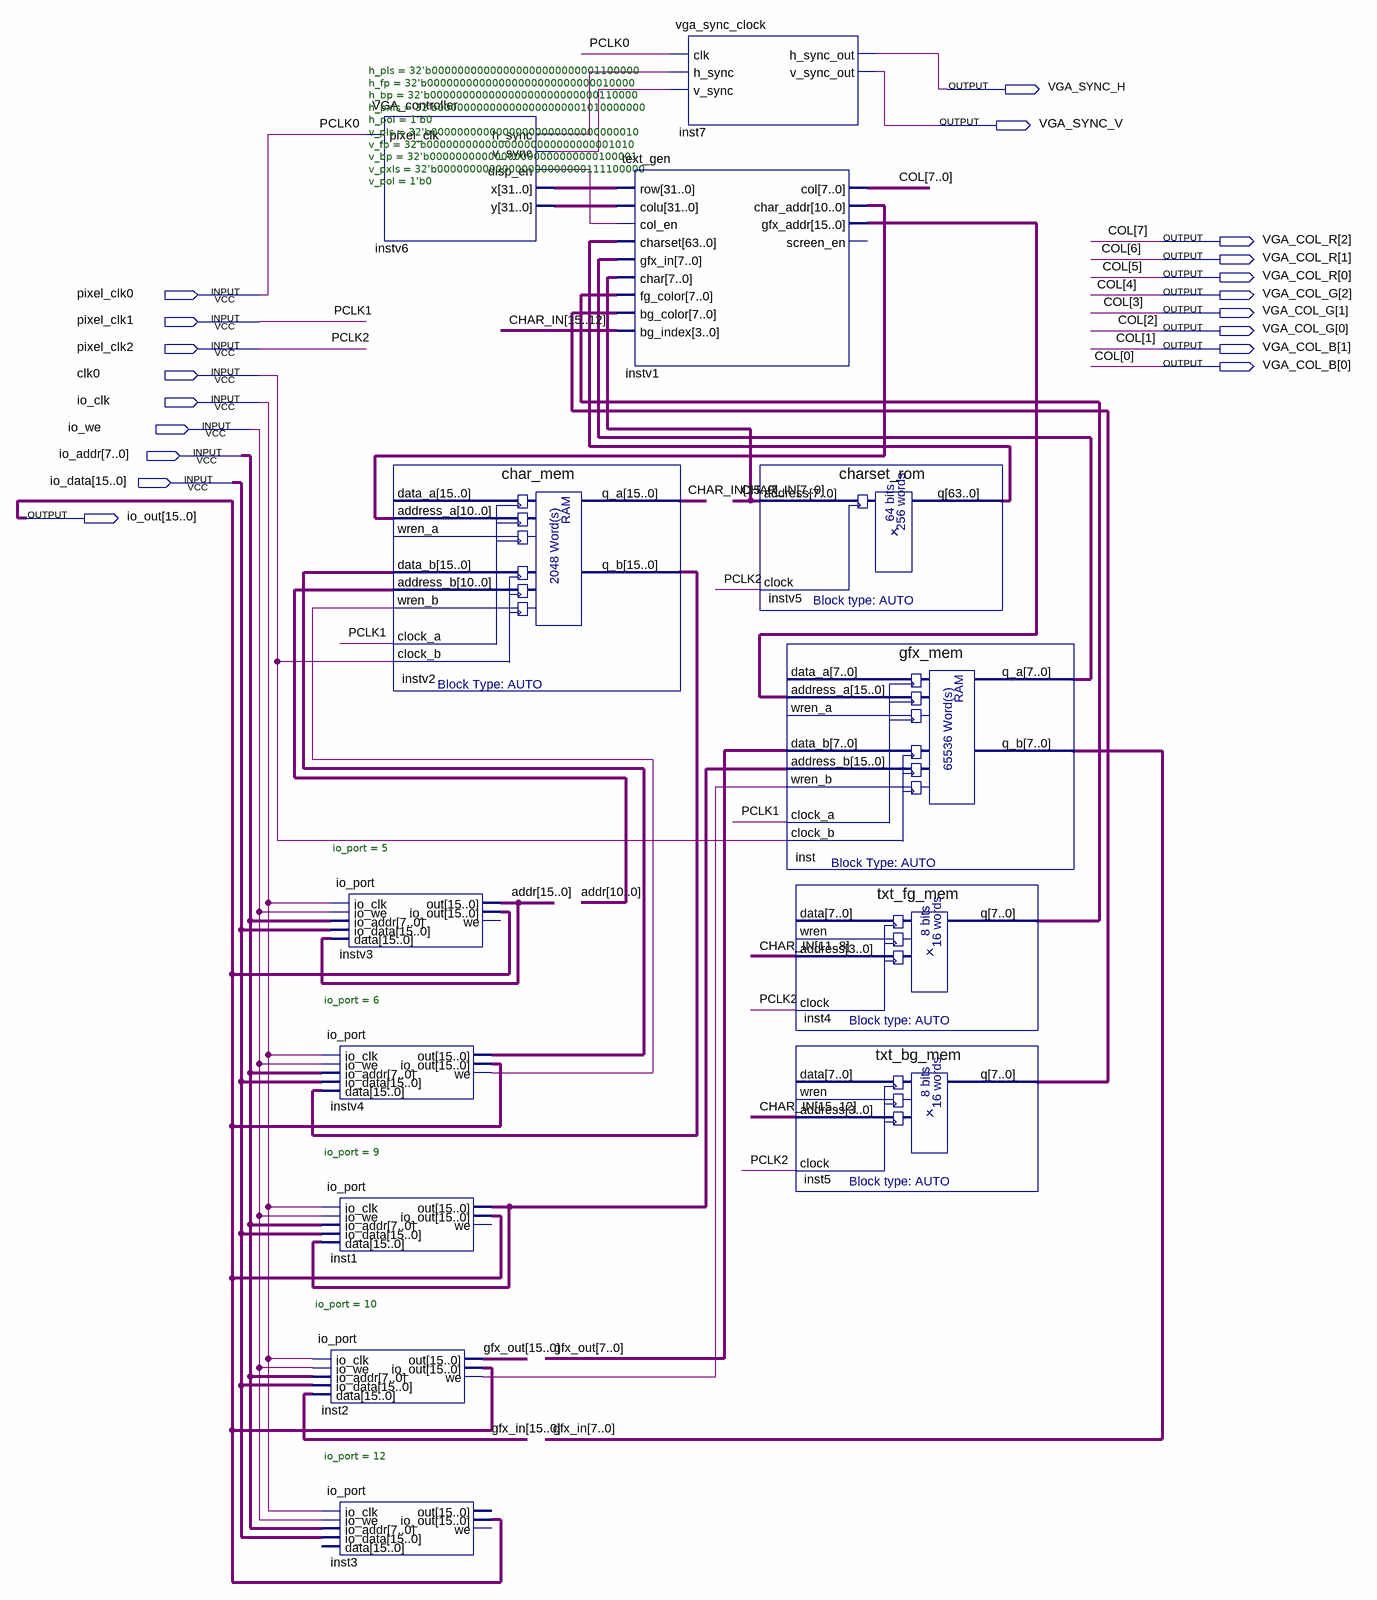
[diagram p0: schematic sheet]
// Quartus schematic vga_io.bdf as structural Verilog: 13 symbols, 19 pins
module vga_io (
  input  pixel_clk0,
  input  pixel_clk1,
  input  pixel_clk2,
  input  clk0,
  input  io_clk,
  input  io_we,
  input  [7:0] io_addr,
  input  [15:0] io_data,
  output VGA_SYNC_H,
  output VGA_SYNC_V,
  output [2:0] VGA_COL_R,
  output [2:0] VGA_COL_G,
  output [1:0] VGA_COL_B,
  output [15:0] io_out
);

  wire inst2_we, instv4_we, instv6_disp_en, instv6_h_sync, instv6_v_sync;
  wire [7:0] inst4_q, inst5_q, inst_q_a;
  wire [10:0] instv1_char_addr;
  wire [15:0] addr, CHAR_IN, gfx_in, gfx_out, inst1_out, instv1_gfx_addr, instv2_q_b, instv4_out;
  wire [31:0] instv6_x, instv6_y;
  wire [63:0] instv5_q;

  io_port #(.io_port(6)) instv4 (
    .io_clk(io_clk), .io_we(io_we), .io_addr(io_addr), .io_data(io_data), .data(instv2_q_b),
    .out(instv4_out), .io_out(io_out), .we(instv4_we));
  io_port #(.io_port(9)) inst1 (
    .io_clk(io_clk), .io_we(io_we), .io_addr(io_addr), .io_data(io_data), .data(inst1_out), .out(inst1_out),
    .io_out(io_out));  // open: we
  io_port #(.io_port(10)) inst2 (
    .io_clk(io_clk), .io_we(io_we), .io_addr(io_addr), .io_data(io_data), .data(gfx_in), .out(gfx_out),
    .io_out(io_out), .we(inst2_we));
  io_port #(.io_port(12)) inst3 (
    .io_clk(io_clk), .io_we(io_we), .io_addr(io_addr), .io_data(io_data), .io_out(io_out));  // open: data, out, we
  VGA_controller #(.h_pls(32'b00000000000000000000000001100000), .h_fp(32'b00000000000000000000000000010000), .h_bp(32'b00000000000000000000000000110000), .h_pxls(32'b00000000000000000000001010000000), .h_pol(1'b0), .v_pls(32'b00000000000000000000000000000010), .v_fp(32'b00000000000000000000000000001010), .v_bp(32'b00000000000000000000000000100001), .v_pxls(32'b00000000000000000000000111100000), .v_pol(1'b0)) instv6 (
    .pixel_clk(pixel_clk0), .h_sync(instv6_h_sync), .v_sync(instv6_v_sync), .disp_en(instv6_disp_en),
    .x(instv6_x), .y(instv6_y));
  char_mem instv2 (
    .address_a(instv1_char_addr), .data_b(instv4_out), .address_b(addr[10:0]), .wren_b(instv4_we),
    .clock_a(pixel_clk1), .clock_b(clk0), .q_a(CHAR_IN), .q_b(instv2_q_b));  // open: data_a, wren_a
  io_port #(.io_port(5)) instv3 (
    .io_clk(io_clk), .io_we(io_we), .io_addr(io_addr), .io_data(io_data), .data(addr), .out(addr),
    .io_out(io_out));  // open: we
  vga_sync_clock inst7 (
    .clk(pixel_clk0), .h_sync(instv6_h_sync), .v_sync(instv6_v_sync), .h_sync_out(VGA_SYNC_H),
    .v_sync_out(VGA_SYNC_V));
  text_gen instv1 (
    .row(instv6_x), .colu(instv6_y), .col_en(instv6_disp_en), .charset(instv5_q), .gfx_in(inst_q_a),
    .char(CHAR_IN[7:0]), .fg_color(inst4_q), .bg_color(inst5_q), .bg_index(CHAR_IN[15:12]),
    .col({VGA_COL_R, VGA_COL_G, VGA_COL_B}), .char_addr(instv1_char_addr), .gfx_addr(instv1_gfx_addr));  // open: screen_en
  charset_rom instv5 (.address(CHAR_IN[7:0]), .clock(pixel_clk2), .q(instv5_q));
  gfx_mem inst (
    .address_a(instv1_gfx_addr), .data_b(gfx_out[7:0]), .address_b(inst1_out), .wren_b(inst2_we),
    .clock_a(pixel_clk1), .clock_b(clk0), .q_a(inst_q_a), .q_b(gfx_in[7:0]));  // open: data_a, wren_a
  txt_fg_mem inst4 (.address(CHAR_IN[11:8]), .clock(pixel_clk2), .q(inst4_q));  // open: data, wren
  txt_bg_mem inst5 (.address(CHAR_IN[15:12]), .clock(pixel_clk2), .q(inst5_q));  // open: data, wren

  // Other names for the same wires on the sheet: COL[7:0] = {VGA_COL_R, VGA_COL_G, VGA_COL_B}; PCLK1 = pixel_clk1;
  //   PCLK2 = pixel_clk2; PCLK0 = pixel_clk0
endmodule
